# EAGLE design switchy_stamp_pth_mk1_buck (EAGLE 6.4)
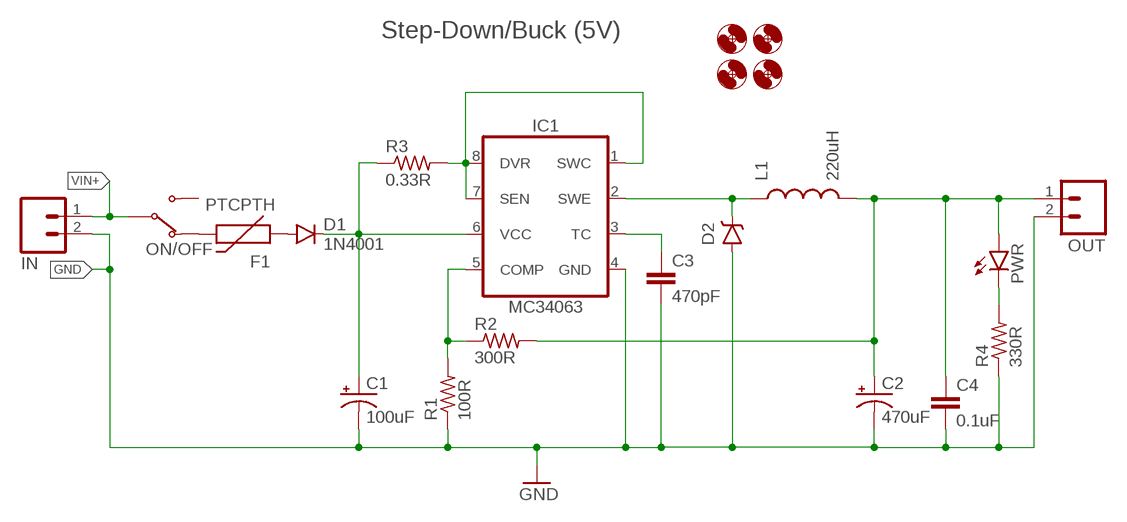
[diagram p0: schematic, sheet 1]

## Parts
C1  100uF  CAPACITOR-POLARIZEDE2.5-7  [E2,5-7]
C2  470uF  CAPACITOR-POLARIZEDE2.5-7  [E2,5-7]
C3  470pF  CAPACITOR-CERAMIC025-024X044  [C025-024X044]
C4  0.1uF  CAPACITOR-CERAMIC025-024X044  [C025-024X044]
D1  1N4001  DIODEPTH-10.68MM  [DIODE-10.16MM]
D2  1N5819  DIODE-SCHOTTKYPTH-10.16MM  [DIODE-10.16MM]
F1  PTCPTH  [PTC]
H1  HOLE#2  [HOLE-#2]
H2  HOLE#2  [HOLE-#2]
H3  HOLE#2  [HOLE-#2]
H4  HOLE#2  [HOLE-#2]
IC1  MC34063  MC34063DIP  [DIP-08]
IN  M02JST-PTH-2  [JST-2-PH-RA-PTH]
L1  220uH  INDUCTORPTH-RADIAL-6MMDIA  [RADIAL-PTH-6MMDIA]
ON/OFF  SWITCH-SPDTSSA-12  [SWITCH-SPDT-SSA-12]
OUT  M02JST-PTH-2  [JST-2-PH-RA-PTH]
PWR  LED3MM  [LED3MM]
R1  100R  RESISTORPTH-AXIAL-5.08MM  [RESISTOR-AXIAL-PTH-5.08MM]
R2  300R  RESISTORPTH-AXIAL-5.08MM  [RESISTOR-AXIAL-PTH-5.08MM]
R3  0.33R  RESISTORPTH-AXIAL-10.16MM  [RESISTOR-AXIAL-PTH-10.16MM]
R4  330R  RESISTORPTH-AXIAL-5.08MM  [RESISTOR-AXIAL-PTH-5.08MM]

## Nets
GND: C1.- C2.- C3.2 C4.2 D2.A IC1.4(GND) IN.2 OUT.2 R1.P$1 R4.P$1
N$1: IC1.1(SWC) IC1.7(SEN) IC1.8(DVR) R3.P$2
N$2: C3.1 IC1.3(TC)
N$3: IC1.5(COMP) R1.P$2 R2.P$1
N$4: D1.A F1.P$1
N$5: C1.+ D1.C IC1.6(VCC) R3.P$1
N$6: D2.C IC1.2(SWE) L1.1
N$7: PWR.K(C) R4.P$2
N$8: F1.P$2 ON/OFF.A(NC)
VIN+: IN.1 ON/OFF.COM
VOUT-: C2.+ C4.1 L1.2 OUT.1 PWR.A R2.P$2
Unconnected: ON/OFF.B(NO)

## Notes on the sheet
- Step-Down/Buck (5V)

## Library data of the parts
C1 C2 = A_butts:CAPACITOR-POLARIZED: POLARIZED CAPACITOR, American symbol
C3 C4 = A_butts:CAPACITOR-CERAMIC: CAPACITOR, European symbol
D1 = A_butts:DIODE: Diode These are standard reverse protection diodes and small signal diodes. SMA package can handle up to about 1A. SOD-323 can handle about 200mA. What the SOD-323 package when ordering, there are some mfgs out there that are 5-pin packages.
D2 = A_butts:DIODE-SCHOTTKY: Schottky diodes in SFE's production catalog BAT20J 1A 23V 0.62Vf RB751 120mA 40V 0.37Vf PMEG4005EJ 0.5A 40V 0.42Vf MBRA140 1A 40V 0.5Vf B340A 3A 40V SMA
F1 = A_butts:PTC: Resettable Fuse PTC Resettable Fuse. Spark Fun Electronics SKU : COM-08357
H1-H4 = A_butts:HOLE: MOUNTING HOLE with drill center marker
IC1 = A_butts:MC34063: Jellybean switching supply controller
IN OUT = A_butts:M02: Standard 2-pin 0.1" header. Use with - straight break away headers ( PRT-00116) - right angle break away headers (PRT-00553) - swiss pins (PRT-00743) - machine pins (PRT-00117) - female headers (PRT-00115) Molex polarized connector foot print use with: PRT-08233 with associated crimp pins and housings. 2.54_SCREWTERM for use with PRT-10571. 3.5mm Screw Terminal footprints for PRT-08084 5mm Screw Terminal footprints for use with PRT-08433; SKU: PRT-09914
L1 = A_butts:INDUCTOR: Inductors Basic Inductor/Choke - 0603 and 1206. Footprints are not proven and vary greatly between part numbers. SRN6045- 33uH, 20% 1.4A SDR0403-560KL - 56uH, 10%, 500mA RMS/740mA peak
ON/OFF = A_butts:SWITCH-SPDT
PWR = A_butts:LED: LEDs Standard schematic elements and footprints for 5mm, 3mm, 1206, and 0603 sized LEDs. 5mm - Spark Fun Electronics SKU : COM-00529 (and others)
R1-R4 = A_butts:RESISTOR: RESISTOR, American symbol

## Board
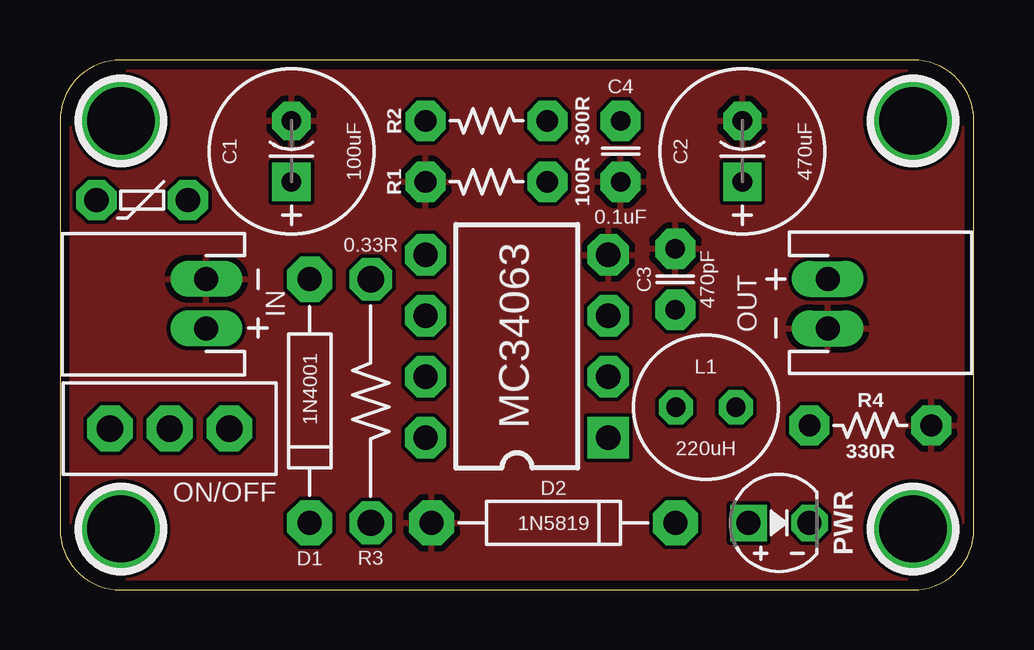
[diagram p1: board, top side]
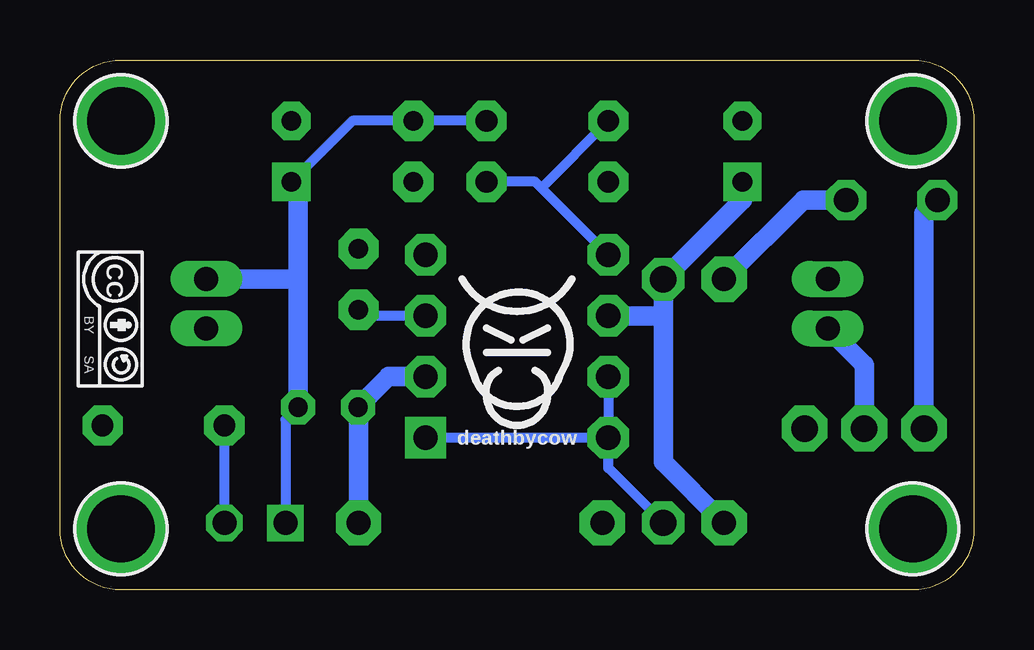
[diagram p2: board, bottom side, seen from below]

Size 38.1 x 22.1 mm. Coordinates in mm from the lower left corner, seen from the top.
Outline: 0,19.56 0,2.54 arc90 2.54,0 35.56,0 arc90 38.1,2.54 38.1,19.56 arc90 35.56,22.1 2.54,22.1 arc90 0,19.56
Copper layers (1*16): Top 0.0356mm / dielectric 1.5011mm / Bottom 0.0356mm
Design rules "LaenPCBOrder2": minimum track width 6mil, minimum drill 13mil, track to track 6mil, track to pad 6mil, pad to pad 6mil, via to via 6mil, smd to smd 6mil, copper to edge 15mil, drill to drill 6mil, minimum pad ring 7mil, minimum via ring 7mil, stop-mask expansion 3mil, vias tented up to drill 20mil, thermal gap 10mil

### Footprints (pad centres in the part's own frame; a part is rotated, then mirrored left to right if it is on the bottom)
E2,5-7 = drill 0.813 pad 1.6 square: + -1.27,0 | drill 0.813 pad 1.6 octagon: - 1.27,0
C025-024X044 = drill 0.813 pad 1.676 octagon: 1 -1.27,0; 2 1.27,0
DIODE-10.16MM = drill 1 pad 1.88 octagon: A -5.08,0; C 5.08,0
PTC = drill 1.016 pad 1.676 octagon: P$1 -1.905,0; P$2 1.905,0
HOLE-#2 = drill 2.8 pad 3.81: P$1 0,0
DIP-08 = drill 1.016 pad 1.727 square: 1 -3.81,-3.81 | drill 1.016 pad 1.727 octagon: 2 -1.27,-3.81; 3 1.27,-3.81; 4 3.81,-3.81; 5 3.81,3.81; 6 1.27,3.81; 7 -1.27,3.81; 8 -3.81,3.81
JST-2-PH-RA-PTH = drill 1 pad 1.5 long: 1 -1.03,0; 2 1.03,0
RADIAL-PTH-6MMDIA = drill 0.8 pad 1.422 octagon: 1 -1.25,0; 2 1.25,0
SWITCH-SPDT-SSA-12 = drill 1.1 pad 1.905 octagon: A -2.489,0; B 2.489,0; COM 0,0
LED3MM = drill 1 pad 1.524 square: A -1.27,0 | drill 1 pad 1.524 octagon: K 1.27,0
RESISTOR-AXIAL-PTH-5.08MM = drill 0.9 pad 1.676 octagon: P$1 -2.54,0; P$2 2.54,0
RESISTOR-AXIAL-PTH-10.16MM = drill 1.1 pad 1.778 octagon: P$1 -5.08,0; P$2 5.08,0

### Placement (x,y rotation side)
C1  9.65,18.29 90 top
C2  28.45,18.29 90 top
C3  25.65,12.95 90 top
C4  23.37,18.29 270 top
D1  10.41,7.87 270 top
D2  20.57,2.79 0 top
F1  3.43,16.26 180 top
H1  2.54,2.54 0 top
H2  2.54,19.56 0 top
H3  35.56,2.54 0 top
H4  35.56,19.56 0 top
IC1  19.05,10.16 90 top
IN  6.1,11.94 90 top
L1  26.92,7.62 0 top
ON/OFF  4.57,6.73 0 top
OUT  32,11.94 270 top
PWR  29.97,2.79 0 top
R1  17.78,17.02 0 top
R2  17.78,19.56 0 top
R3  12.95,7.87 270 top
R4  33.78,6.86 180 top
U$1  [COW_SMALL]  19.05,10.41 0 bottom
U$2  [CC-BY-SA-4.0-NO-URL]  35.81,12.95 270 bottom

### Tracks (layer width: path | path; a pad name or v marks a point on that pad's centre or on a via)
GND
  pour Top: 35.56,0 2.54,0 arc-90 0,2.54 0,19.56 arc-90 2.54,22.1 35.56,22.1 arc-90 38.1,19.56 38.1,2.54 arc-90
N$1
  Bottom 0.406: R3.P$2 15.24,5.08 15.24,6.1 | 15.24,6.1 IC1.8 IC1.7 | IC1.1 15.49,6.35 15.24,6.1
N$2
  Bottom 0.406: IC1.3 25.4,11.43 C3.1
N$3
  Bottom 0.406: IC1.5 18.03,16.76 | 18.03,16.76 18.29,17.02 R1.P$2 | R2.P$1 18.03,16.76
N$4
  Bottom 0.813: F1.P$1 7.11,16.26 D1.A
N$5
  Bottom 0.813: C1.+ 9.65,16.26 R3.P$1 12.95,11.43 | IC1.6 12.95,11.43 | 12.95,11.43 12.95,5.33 D1.C
N$6
  Bottom 0.813: IC1.2 24.4,8.89 L1.1 25.65,7.6 D2.C
N$7
  Bottom 0.406: PWR.K R4.P$2
N$8
  Bottom 0.813: F1.P$2 2.08,15.7 ON/OFF.A
VIN+
  Bottom 0.813: ON/OFF.COM 4.57,9.38 IN.1
VOUT-
  Bottom 0.406: L1.2 28.7,7.09 PWR.A | R2.P$2 C4.1 25.91,19.56 C2.+
  Bottom 0.813: C2.+ 28.17,16.74 28.17,12.95 | 28.17,12.95 L1.2 | OUT.1 31.99,12.95 28.17,12.95